# EAGLE schematic radio_oled (EAGLE 8.4.2)
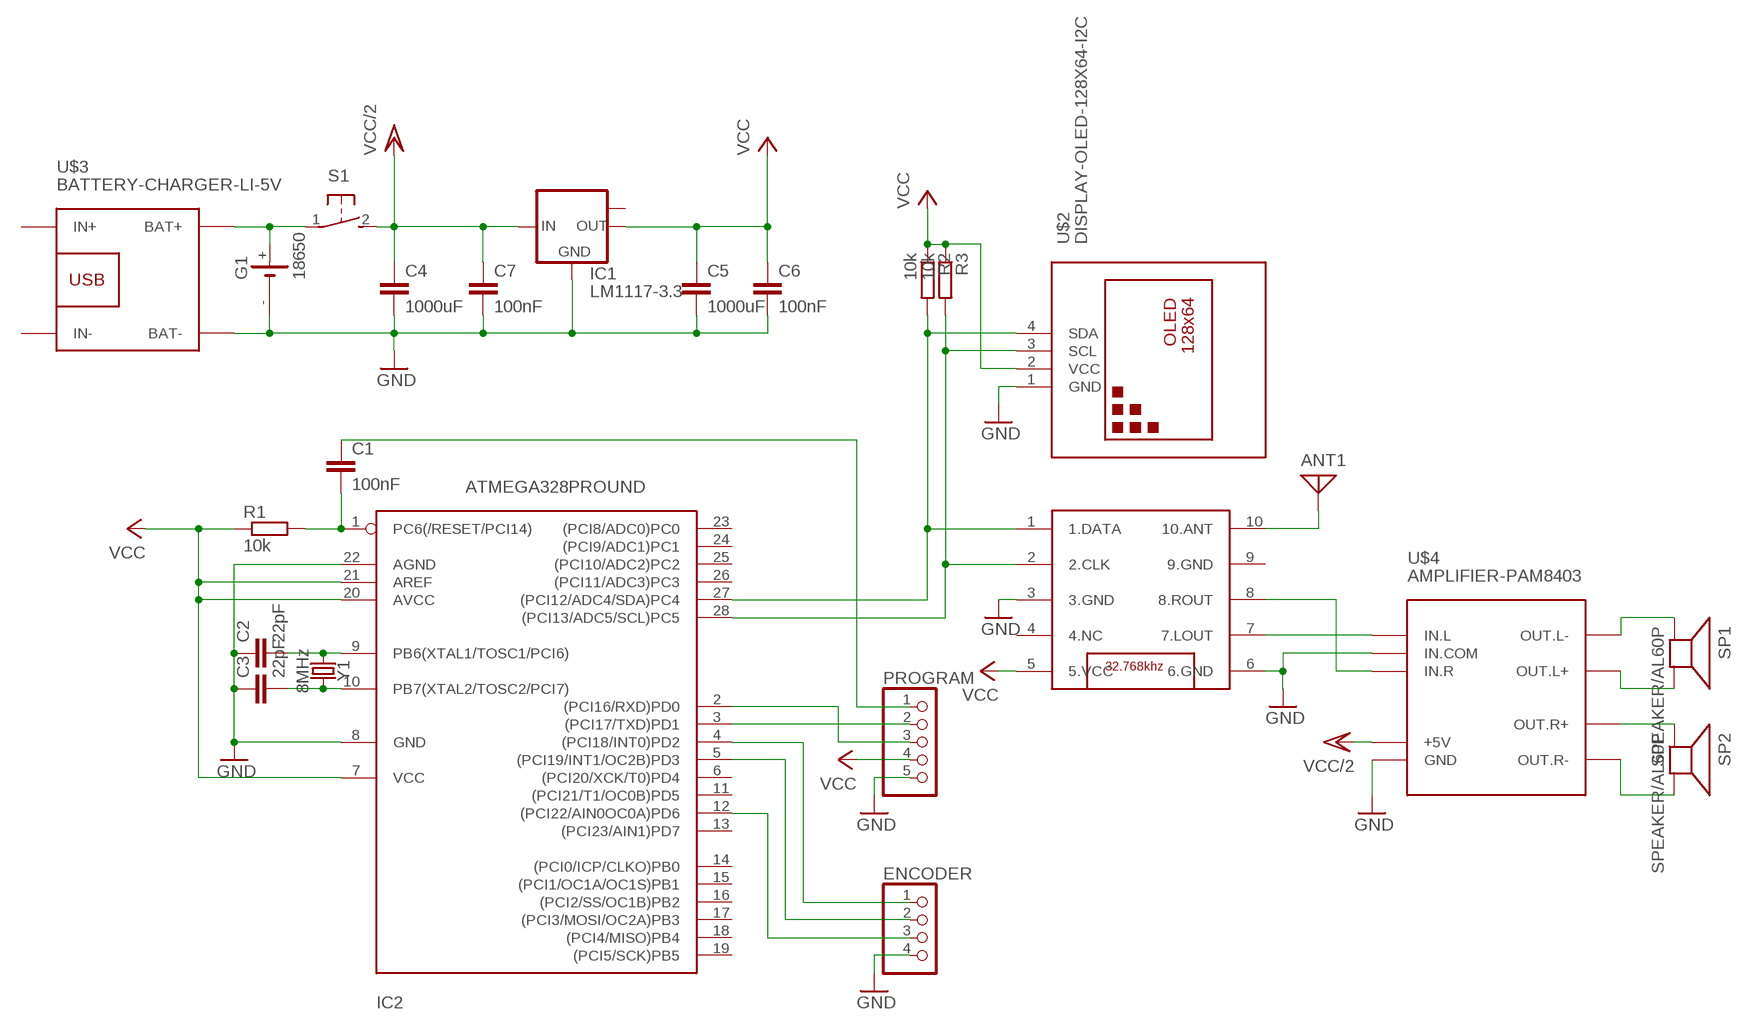
[diagram p0: schematic, sheet 1]

## Parts
ANT1  ANTENNA  [PAD-01]
C1  100nF  C-EU025-025X050  [C025-025X050]
C2  22pF  C-EU025-025X050  [C025-025X050]
C3  22pF  C-EU025-025X050  [C025-025X050]
C4  1000uF  C-EU025-025X050  [C025-025X050]
C5  1000uF  C-EU025-025X050  [C025-025X050]
C6  100nF  C-EU025-025X050  [C025-025X050]
C7  100nF  C-EU025-025X050  [C025-025X050]
ENCODER  PINHD-1X4  [1X04]
G1  18650  SL-160AA/PT  [SL-160AA/PT]
IC1  LM1117-3.3  LM1117IMPX-3.3  [SOT223]
IC2  ATMEGA328PROUND  [DIL28-3-ROUND]
PROGRAM  PINHD-1X5  [1X05]
R1  10k  R-EU_0204/7  [0204/7]
R2  10k  R-EU_0204/7  [0204/7]
R3  10k  R-EU_0204/7  [0204/7]
S1  31-XX  [B3F-31XX]
SP1  SPEAKER/AL60P  [AL60P]
SP2  SPEAKER/AL60P  [AL60P]
U$1  TEA5767  [TJ-102BC]
U$2  DISPLAY-OLED-128X64-I2C  [DISPLAY-OLED-128X64-I2C]
U$3  BATTERY-CHARGER-LI-5V  [BATTERY-CHARGER-LI-5V]
U$4  AMPLIFIER-PAM8403  [AMPLIFIER-PAM8403]
Y1  8MHz  CRYSTAL-8MHZSMD-HC49UP  [HC49UP]

## Nets
GND: C2.1 C3.1 C4.2 C5.2 C6.2 C7.2 ENCODER.4 G1.- IC1.1(GND) IC2.8(GND) IC2.22(AGND) PROGRAM.5 U$1.3(3.GND) U$1.6(6.GND) U$2.1(GND) U$3.BAT- U$4.GND U$4.IN.COM
N$1: IC2.3((PCI17/TXD)PD1) PROGRAM.2
N$2: IC2.2((PCI16/RXD)PD0) PROGRAM.3
N$3: C1.2 IC2.1(PC6(/RESET/PCI14)) R1.2
N$4: C1.1 PROGRAM.1
N$5: IC2.27((PCI12/ADC4/SDA)PC4) R2.2 U$1.1(1.DATA) U$2.4(SDA)
N$6: IC2.28((PCI13/ADC5/SCL)PC5) R3.2 U$1.2(2.CLK) U$2.3(SCL)
N$7: C2.2 IC2.9(PB6(XTAL1/TOSC1/PCI6)) Y1.1
N$8: ANT1.1 U$1.10(10.ANT)
N$9: C3.2 IC2.10(PB7(XTAL2/TOSC2/PCI7)) Y1.2
N$10: ENCODER.1 IC2.4((PCI18/INT0)PD2)
N$11: ENCODER.2 IC2.5((PCI19/INT1/OC2B)PD3)
N$12: ENCODER.3 IC2.12((PCI22/AIN0OC0A)PD6)
N$13: G1.+ S1.1(P) U$3.BAT+
N$14: U$1.7(7.LOUT) U$4.IN.L
N$15: U$1.8(8.ROUT) U$4.IN.R
N$16: SP1.1(+) U$4.OUT.L-
N$17: SP1.2(-) U$4.OUT.L+
N$18: SP2.1(+) U$4.OUT.R+
N$19: SP2.2(-) U$4.OUT.R-
VCC: C5.1 C6.1 IC1.2(OUT) IC2.7(VCC) IC2.20(AVCC) IC2.21(AREF) PROGRAM.4 R1.1 R2.1 R3.1 U$1.5(5.VCC) U$2.2(VCC)
VCC/2: C4.1 C7.1 IC1.3(IN) S1.2(S) U$4.+5V
Unconnected: G1.-@1(-) IC1.TAB(OUT1) IC2.6((PCI20/XCK/T0)PD4) IC2.11((PCI21/T1/OC0B)PD5) IC2.13((PCI23/AIN1)PD7) IC2.14((PCI0/ICP/CLKO)PB0) IC2.15((PCI1/OC1A/OC1S)PB1) IC2.16((PCI2/SS/OC1B)PB2) IC2.17((PCI3/MOSI/OC2A)PB3) IC2.18((PCI4/MISO)PB4) IC2.19((PCI5/SCK)PB5) IC2.23((PCI8/ADC0)PC0) IC2.24((PCI9/ADC1)PC1) IC2.25((PCI10/ADC2)PC2) IC2.26((PCI11/ADC3)PC3) U$1.4(4.NC) U$1.9(9.GND) U$3.IN+ U$3.IN-

## Library data of the parts
ANT1 = discrete:ANTENNA: Antenna
C1-C7 = rcl:C-EU: CAPACITOR, European symbol
ENCODER = pinhead:PINHD-1X4: PIN HEADER
G1 = battery:SL-160AA/PT: LI BATTERY Sonnenschein
IC1 = lm1117:LM1117IMPX-*
IC2 = atmega328:ATMEGA328*P: MICROCONTROLLER 32 kBytes FLASH 2 kBytes SRAM 1 kBytes EEPROM USART 8-channel 10 bit ADC
PROGRAM = pinhead:PINHD-1X5: PIN HEADER
R1-R3 = rcl:R-EU_: RESISTOR, European symbol
S1 = adafruit:31-XX: OMRON SWITCH Now with beefier pads!
SP1 SP2 = adafruit:SPEAKER: SPEAKER Source: Buerklin Added PS12 (for part # PS1240 piezo) http://www.ladyada.net/library/pcb/eaglelibrary.html
U$1 = TEA5767:TEA5767
U$2 = diy-modules:DISPLAY-OLED-128X64-I2C: 128x64 Dot Matrix OLED Module based on SSD1306 chip Variant with I2C interface More details available here: http://www.instructables.com/id/Monochrome-096-i2c-OLED-display-with-arduino-SSD13/ SSD1306 datasheet: https://cdn-shop.adafruit.com/datasheets/SSD1306.pdf Click here to find device on ebay.com <http://www.ebay.com/sch/oled+display+128x64+iic> Note: There are two variants: I2C and SPI. Search for the proper version.
U$3 = diy-modules:BATTERY-CHARGER-LI-5V: Lithium Battery 5V Charger More details available here: http://www.buildcircuit.com/how-to-use-micro-usb-5v-1a-lithium-battery-charging-board-charger-module/ Click here to find device on ebay.com <http://www.ebay.com/sch/tp4056+charger+usb>
U$4 = diy-modules:AMPLIFIER-PAM8403: Stereo Class-D 3W Audio Amplifier based on PAM8403 chip More details available here: http://artofcircuits.com/product/pam8403-5v-two-channel-stereo-mini-class-d-3w3w-audio-amplifier Click here to find device on ebay.com <http://www.ebay.com/sch/pam8403+mini+class+d>
Y1 = SparkFun-Clocks:CRYSTAL-8MHZ: 8MHz Crystal Datasheet Example <http://www.futureelectronics.com/en/technologies/electromechanical/timing-devices/crystals/Pages/6008189-ABM3B-8.000MHZ-B2-T.aspx?IM=0> Frequency: 8MHz Frequency Tolerance: ±20ppm Load Capacitance: 18pF SparkFun Products: Pro Micro -3.3V/8MHz <https://www.sparkfun.com/products/12587> WAV Trigger <https://www.sparkfun.com/products/13660>; PROD_ID: XTAL-11706